# EAGLE design HitBoxV0.3 (EAGLE 9.1.3)
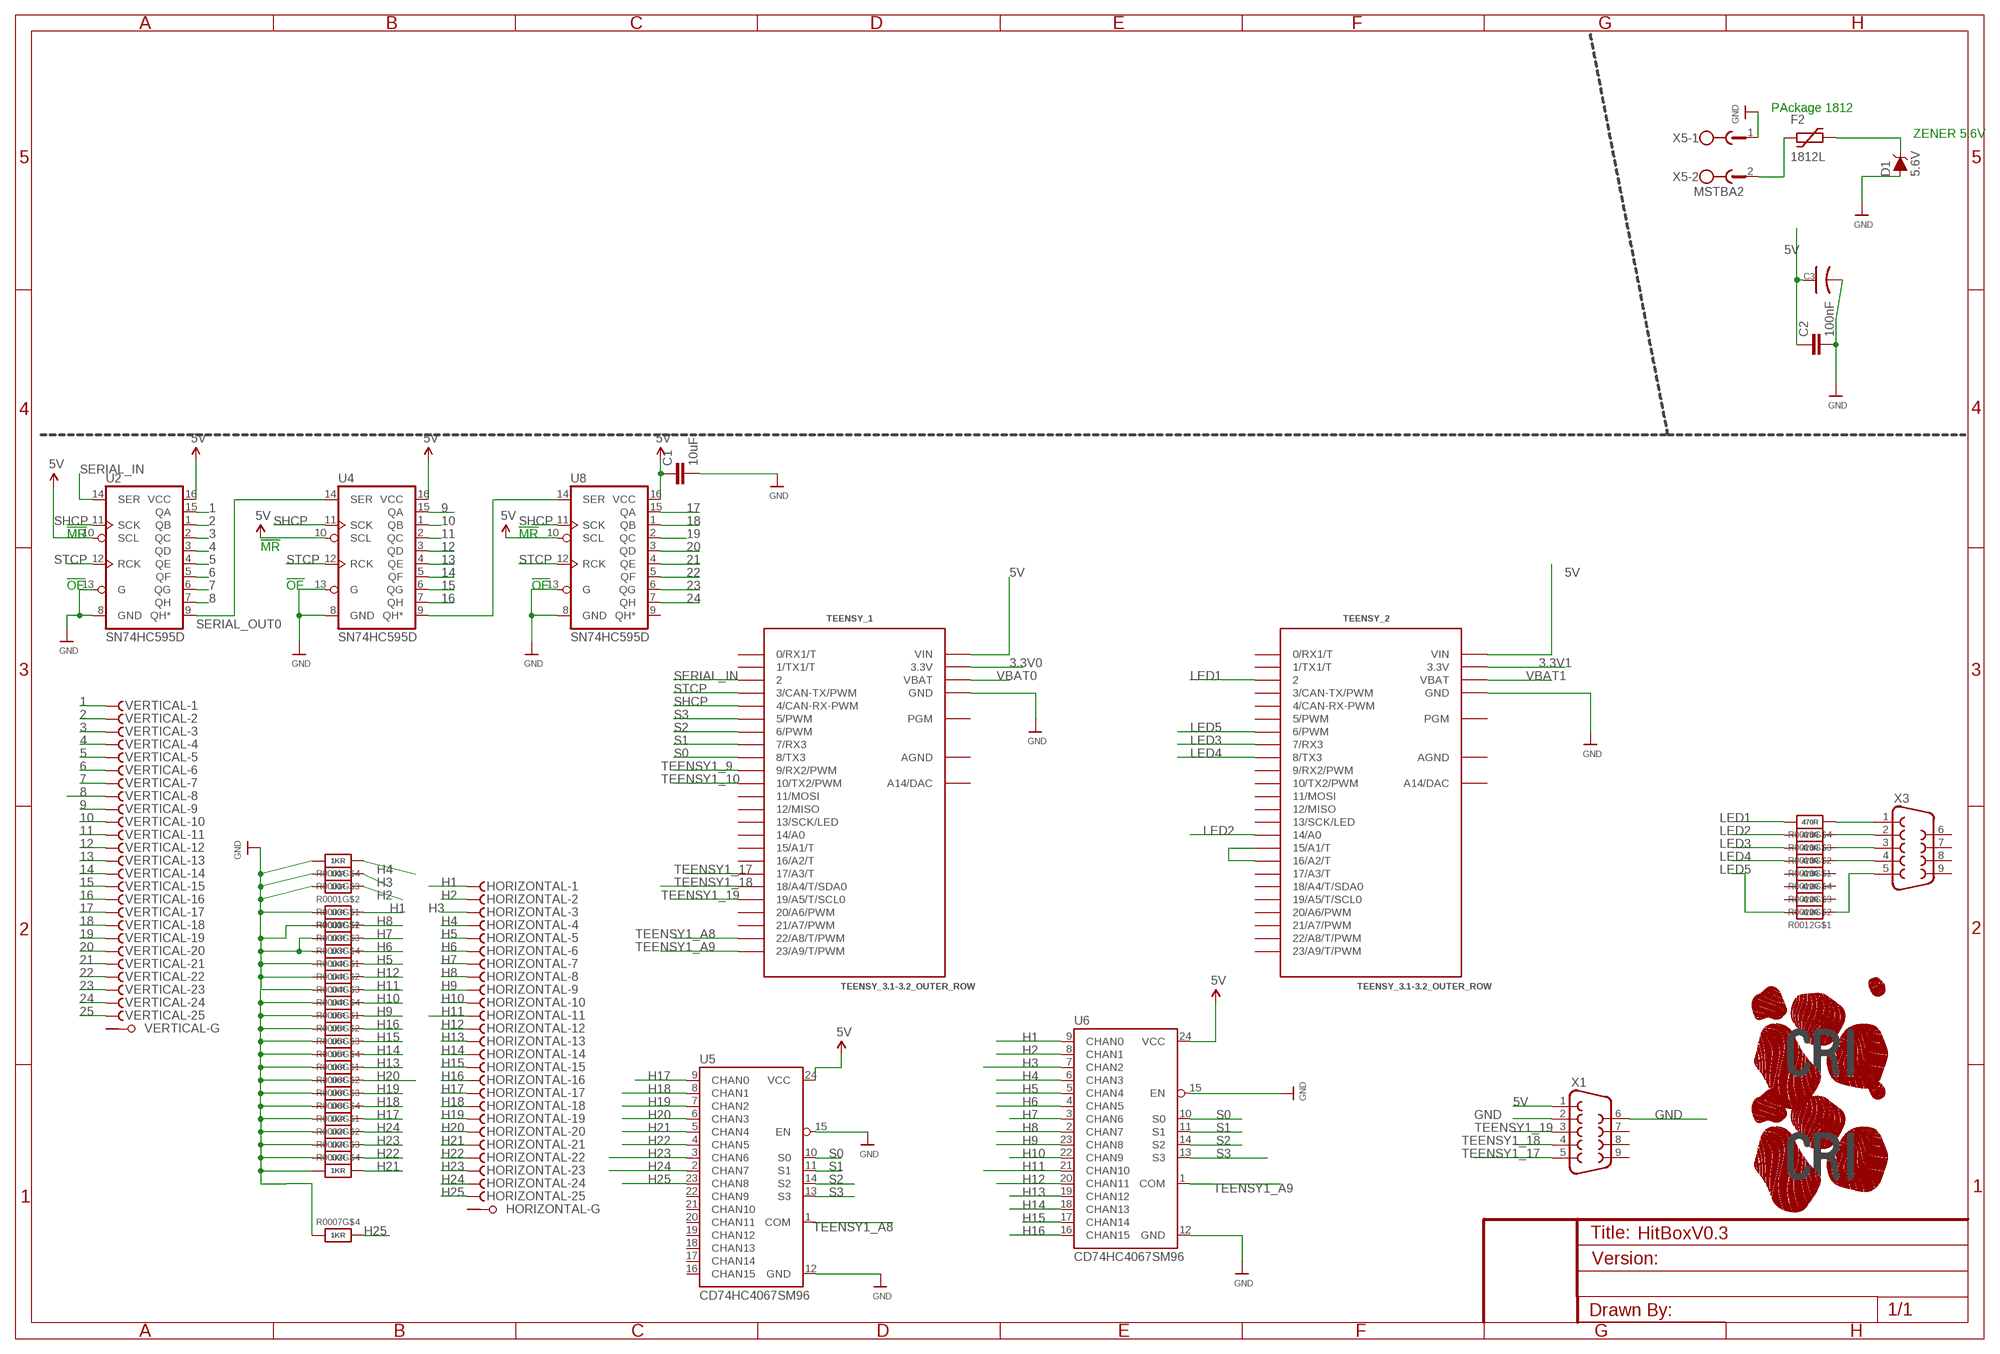
[diagram p0: schematic, sheet 1]

## Parts
C1  10uF  CAP0402-10UF-KEMET  [0402-CAP]
C2  100nF  C-EUC0805  [C0805]
C3  C-POLAR8MMX10MM  [CAP-POL-8MMX10MM]
D1  5.6V  DIODE-ZENER-MMSZ5232BS  [SOD-323]
F2  1812L  [1812L]
HORIZONTAL  F25VPS  [F25VP]
R0001  1KR  RESISTOR_4PACK  [RESPACK_4X0603]
R0002  1KR  RESISTOR_4PACK  [RESPACK_4X0603]
R0003  1KR  RESISTOR_4PACK  [RESPACK_4X0603]
R0004  1KR  RESISTOR_4PACK  [RESPACK_4X0603]
R0005  1KR  RESISTOR_4PACK  [RESPACK_4X0603]
R0006  1KR  RESISTOR_4PACK  [RESPACK_4X0603]
R0007  1KR  RESISTOR_4PACK  [RESPACK_4X0603]
R0012  470R  RESISTOR_4PACK  [RESPACK_4X0603]
R0013  470R  RESISTOR_4PACK  [RESPACK_4X0603]
TEENSY_1  TEENSY_3.1-3.2_OUTER_ROW  [TEENSY_3.0-3.2&LC_OUTER_ROW]
TEENSY_2  TEENSY_3.1-3.2_OUTER_ROW  [TEENSY_3.0-3.2&LC_OUTER_ROW]
U2  SN74HC595D  74HC595D  [SO16]
U4  SN74HC595D  74HC595D  [SO16]
U5  CD74HC4067SM96  74HC4067SM96  [SSOP24]
U6  CD74HC4067SM96  74HC4067SM96  [SSOP24]
U8  SN74HC595D  74HC595D  [SO16]
U$8  LOGO-CRI-NEW-150MM-TOP-TPLACE  [LOGO_CRI-NEW-BMP50MM-TOP]
U$10  LOGO-CRI-NEW-130MMX30MM-TPLACE  [LOGO_CRI-NEW-BMP30MM-TOP]
VERTICAL  F25VPS  [F25VP]
X1  F09VP  [F09VP]
X3  F09VP  [F09VP]
X5  MSTBA2  [MSTBA2]

## Nets
1: U2.15(QA) VERTICAL.1(-1:F)
2: U2.1(QB) VERTICAL.2(-2:F)
3: U2.2(QC) VERTICAL.3(-3:F)
3.3V0: TEENSY_1.3.3V TEENSY_1.3.3V1(3.3V)
3.3V1: TEENSY_2.3.3V TEENSY_2.3.3V1(3.3V)
4: U2.3(QD) VERTICAL.4(-4:F)
5: U2.4(QE) VERTICAL.5(-5:F)
5V: C1.1 C2.1 C3.+ D1.C F2.P$2 TEENSY_1.VIN TEENSY_2.VIN U2.10(SCL) U2.16(VCC) U4.10(SCL) U4.16(VCC) U5.24(VCC) U6.24(VCC) U8.10(SCL) U8.16(VCC) X1.1
6: U2.5(QF) VERTICAL.6(-6:F)
7: U2.6(QG) VERTICAL.7(-7:F)
8: U2.7(QH) VERTICAL.8(-8:F)
9: U4.15(QA) VERTICAL.9(-9:F)
10: U4.1(QB) VERTICAL.10(-10:F)
11: U4.2(QC) VERTICAL.11(-11:F)
12: U4.3(QD) VERTICAL.12(-12:F)
13: U4.4(QE) VERTICAL.13(-13:F)
14: U4.5(QF) VERTICAL.14(-14:F)
15: U4.6(QG) VERTICAL.15(-15:F)
16: U4.7(QH) VERTICAL.16(-16:F)
17: U8.15(QA) VERTICAL.17(-17:F)
18: U8.1(QB) VERTICAL.18(-18:F)
19: U8.2(QC) VERTICAL.19(-19:F)
20: U8.3(QD) VERTICAL.20(-20:F)
21: U8.4(QE) VERTICAL.21(-21:F)
22: U8.5(QF) VERTICAL.22(-22:F)
23: U8.6(QG) VERTICAL.23(-23:F)
24: U8.7(QH) VERTICAL.24(-24:F)
25: VERTICAL.25(-25:F)
GND: C1.2 C2.2 C3.- D1.A R0001.5 R0001.6 R0001.7 R0001.8 R0002.1 R0002.2 R0002.3 R0002.4 R0003.1 R0003.2 R0003.3 R0003.4 R0004.1 R0004.2 R0004.3 R0004.4 R0005.1 R0005.2 R0005.3 R0005.4 R0006.1 R0006.2 R0006.3 R0006.4 R0007.4 TEENSY_1.GND TEENSY_1.GND1(GND) TEENSY_2.GND TEENSY_2.GND1(GND) U2.8(GND) U2.13(G) U4.8(GND) U4.13(G) U5.12(GND) U5.15(EN) U6.12(GND) U6.15(EN) U8.8(GND) U8.13(G) X1.2 X1.6 X5.1
H1: HORIZONTAL.1(-1:F) R0001.1 U6.9(CHAN0)
H2: HORIZONTAL.2(-2:F) R0001.2 U6.8(CHAN1)
H3: HORIZONTAL.3(-3:F) R0001.3 U6.7(CHAN2)
H4: HORIZONTAL.4(-4:F) R0001.4 U6.6(CHAN3)
H5: HORIZONTAL.5(-5:F) R0003.5 U6.5(CHAN4)
H6: HORIZONTAL.6(-6:F) R0003.6 U6.4(CHAN5)
H7: HORIZONTAL.7(-7:F) R0003.7 U6.3(CHAN6)
H8: HORIZONTAL.8(-8:F) R0003.8 U6.2(CHAN7)
H9: HORIZONTAL.9(-9:F) R0004.5 U6.23(CHAN8)
H10: HORIZONTAL.10(-10:F) R0004.6 U6.22(CHAN9)
H11: HORIZONTAL.11(-11:F) R0004.7 U6.21(CHAN10)
H12: HORIZONTAL.12(-12:F) R0004.8 U6.20(CHAN11)
H13: HORIZONTAL.13(-13:F) R0005.5 U6.19(CHAN12)
H14: HORIZONTAL.14(-14:F) R0005.6 U6.18(CHAN13)
H15: HORIZONTAL.15(-15:F) R0005.7 U6.17(CHAN14)
H16: HORIZONTAL.16(-16:F) R0005.8 U6.16(CHAN15)
H17: HORIZONTAL.17(-17:F) R0006.5 U5.9(CHAN0)
H18: HORIZONTAL.18(-18:F) R0006.6 U5.8(CHAN1)
H19: HORIZONTAL.19(-19:F) R0006.7 U5.7(CHAN2)
H20: HORIZONTAL.20(-20:F) R0006.8 U5.6(CHAN3)
H21: HORIZONTAL.21(-21:F) R0002.5 U5.5(CHAN4)
H22: HORIZONTAL.22(-22:F) R0002.6 U5.4(CHAN5)
H23: HORIZONTAL.23(-23:F) R0002.7 U5.3(CHAN6)
H24: HORIZONTAL.24(-24:F) R0002.8 U5.2(CHAN7)
H25: HORIZONTAL.25(-25:F) R0007.5 U5.23(CHAN8)
LED1: R0013.5 TEENSY_2.2
LED2: R0013.6 TEENSY_2.14/A0
LED3: R0013.7 TEENSY_2.7(7/RX3)
LED4: R0013.8 TEENSY_2.8(8/TX3)
LED5: R0012.8 TEENSY_2.6(6/PWM)
N$2: R0013.4 X3.1
N$3: R0013.3 X3.2
N$4: U4.9(QH*) U8.14(SER)
N$6: R0013.2 X3.3
N$7: R0013.1 X3.4
N$8: TEENSY_2.15/A1(15/A1/T) TEENSY_2.16/A2(16/A2/T)
N$10: F2.P$1 X5.2
N$20: R0012.1 X3.5
S0: TEENSY_1.8(8/TX3) U5.10(S0) U6.10(S0)
S1: TEENSY_1.7(7/RX3) U5.11(S1) U6.11(S1)
S2: TEENSY_1.6(6/PWM) U5.14(S2) U6.14(S2)
S3: TEENSY_1.5(5/PWM) U5.13(S3) U6.13(S3)
SERIAL_IN: TEENSY_1.2 U2.14(SER)
SERIAL_OUT0: U2.9(QH*) U4.14(SER)
SHCP: TEENSY_1.4(4/CAN-RX-PWM) U2.11(SCK) U4.11(SCK) U8.11(SCK)
STCP: TEENSY_1.3(3/CAN-TX/PWM) U2.12(RCK) U4.12(RCK) U8.12(RCK)
TEENSY1_9: TEENSY_1.9(9/RX2/PWM)
TEENSY1_10: TEENSY_1.10(10/TX2/PWM)
TEENSY1_17: TEENSY_1.17/A3(17/A3/T) X1.5
TEENSY1_18: TEENSY_1.18/A4(18/A4/T/SDA0) X1.4
TEENSY1_19: TEENSY_1.19/A5(19/A5/T/SCL0) X1.3
TEENSY1_A8: TEENSY_1.22/A8(22/A8/T/PWM) U5.1(COM)
TEENSY1_A9: TEENSY_1.23/A9(23/A9/T/PWM) U6.1(COM)
VBAT0: TEENSY_1.VBAT
VBAT1: TEENSY_2.VBAT
Unconnected: HORIZONTAL.G1(-G:G1) HORIZONTAL.G2(-G:G2) R0007.1 R0007.2 R0007.3 R0007.6 R0007.7 R0007.8 R0012.2 R0012.3 R0012.4 R0012.5 R0012.6 R0012.7 TEENSY_1.0(0/RX1/T) TEENSY_1.1(1/TX1/T) TEENSY_1.11(11/MOSI) TEENSY_1.12(12/MISO) TEENSY_1.13(13/SCK/LED) TEENSY_1.14/A0 TEENSY_1.15/A1(15/A1/T) TEENSY_1.16/A2(16/A2/T) TEENSY_1.20/A6(20/A6/PWM) TEENSY_1.21/A7(21/A7/PWM) TEENSY_1.PGM TEENSY_1.RESET/DAC(A14/DAC) TEENSY_2.0(0/RX1/T) TEENSY_2.1(1/TX1/T) TEENSY_2.3(3/CAN-TX/PWM) TEENSY_2.4(4/CAN-RX-PWM) TEENSY_2.5(5/PWM) TEENSY_2.9(9/RX2/PWM) TEENSY_2.10(10/TX2/PWM) TEENSY_2.11(11/MOSI) TEENSY_2.12(12/MISO) TEENSY_2.13(13/SCK/LED) TEENSY_2.17/A3(17/A3/T) TEENSY_2.18/A4(18/A4/T/SDA0) TEENSY_2.19/A5(19/A5/T/SCL0) TEENSY_2.20/A6(20/A6/PWM) TEENSY_2.21/A7(21/A7/PWM) TEENSY_2.22/A8(22/A8/T/PWM) TEENSY_2.23/A9(23/A9/T/PWM) TEENSY_2.PGM TEENSY_2.RESET/DAC(A14/DAC) U5.16(CHAN15) U5.17(CHAN14) U5.18(CHAN13) U5.19(CHAN12) U5.20(CHAN11) U5.21(CHAN10) U5.22(CHAN9) U8.9(QH*) VERTICAL.G1(-G:G1) VERTICAL.G2(-G:G2) X1.7 X1.8 X1.9 X3.6 X3.7 X3.8 X3.9

## Notes on the sheet
- PAckage 1812
- ZENER 5.6V
- !MR! | !MR!
- !MR!
- !OE! | !OE! | !OE!

## Power pins joined to a net without a drawn wire
AGND: TEENSY_1.AGND TEENSY_2.AGND

## Library data of the parts
C1 = movuino:CAP: Capacitor Standard 0402 ceramic capacitor 0.1uF , 100nF; DIELECTRIC: MLCC, X5R; MF: Kemet; MPN: C0402C106M9PACTU; OC_MOUSER: 80-C0402C106M9P; TOLERANCE: 20%; VOLTAGE: 6.3V
C2 = resistor:C-EU: CAPACITOR, European symbol
C3 = movuinoV0:C-POLAR*
D1 = SparkFun-DiscreteSemi:DIODE-ZENER: Zener Diode A Zener diode allows current to flow from its anode to its cathode like a normal semiconductor diode, but it also permits current to flow in the reverse direction when its "Zener voltage" is reached. - WIkipedia; PROD_ID: DIO-12442
F2 = ptc-littlefuse:1812L
HORIZONTAL VERTICAL = con-subd:F25VPS: SUB-D; OC_FARNELL: unknown; OC_NEWARK: unknown
R0001-R0007 R0012 R0013 = microbuilder:RESISTOR_4PACK: Resistor Packs (4 resistors) 4 x 0603 10K 1/16W - Digikey: YC164J-10KCT-ND
TEENSY_1 TEENSY_2 = Teensy_3_and_LC_Series_Boards_v1.4:TEENSY_3.1-3.2_OUTER_ROW: Footprint for Teensy 3.1 or 3.2 board using all pin connections on the outer perimeter
U2 U4 U8 = SparkFun-IC-Logic:74*595: 8-Bit Shift Register (Serial to Parallel) Datasheet <http://cdn.sparkfun.com/datasheets/BreakoutBoards/MM74HC595.pdf> SparkFun Products SparkFun Shift Register Breakout - 74HC595 <https://www.sparkfun.com/products/10680> (BOB-10680); PROD_ID: IC-07875
U5 U6 = SparkFun-IC-Logic:74*4067: 16-channel analog MUX Datasheet <http://www.sparkfun.com/datasheets/IC/cd74hc4067.pdf> SparkFun Products MP3 Trigger <https://www.sparkfun.com/products/13720> (WIG-13720) SparkFun Analog/Digital MUX Breakout - CD74HC4067 <https://www.sparkfun.com/products/9056> (BOB-09056); PROD_ID: IC-08252
U$8 U$10 = movuino_aestheticsV0:LOGO-CRI-NEW-1
X1 X3 = con-subd:F09: SUB-D; OC_FARNELL: unknown; OC_NEWARK: unknown
X5 = con-phoenix-508:MSTBA2: PHOENIX; MF: FARNELL; MPN: 1757242; OC_FARNELL: 3705171; OC_NEWARK: 71C4161

## Net classes
1 pcbway_smallest: width 0.102 mm, drill 0.2 mm, clearance 0.102 mm

## Board
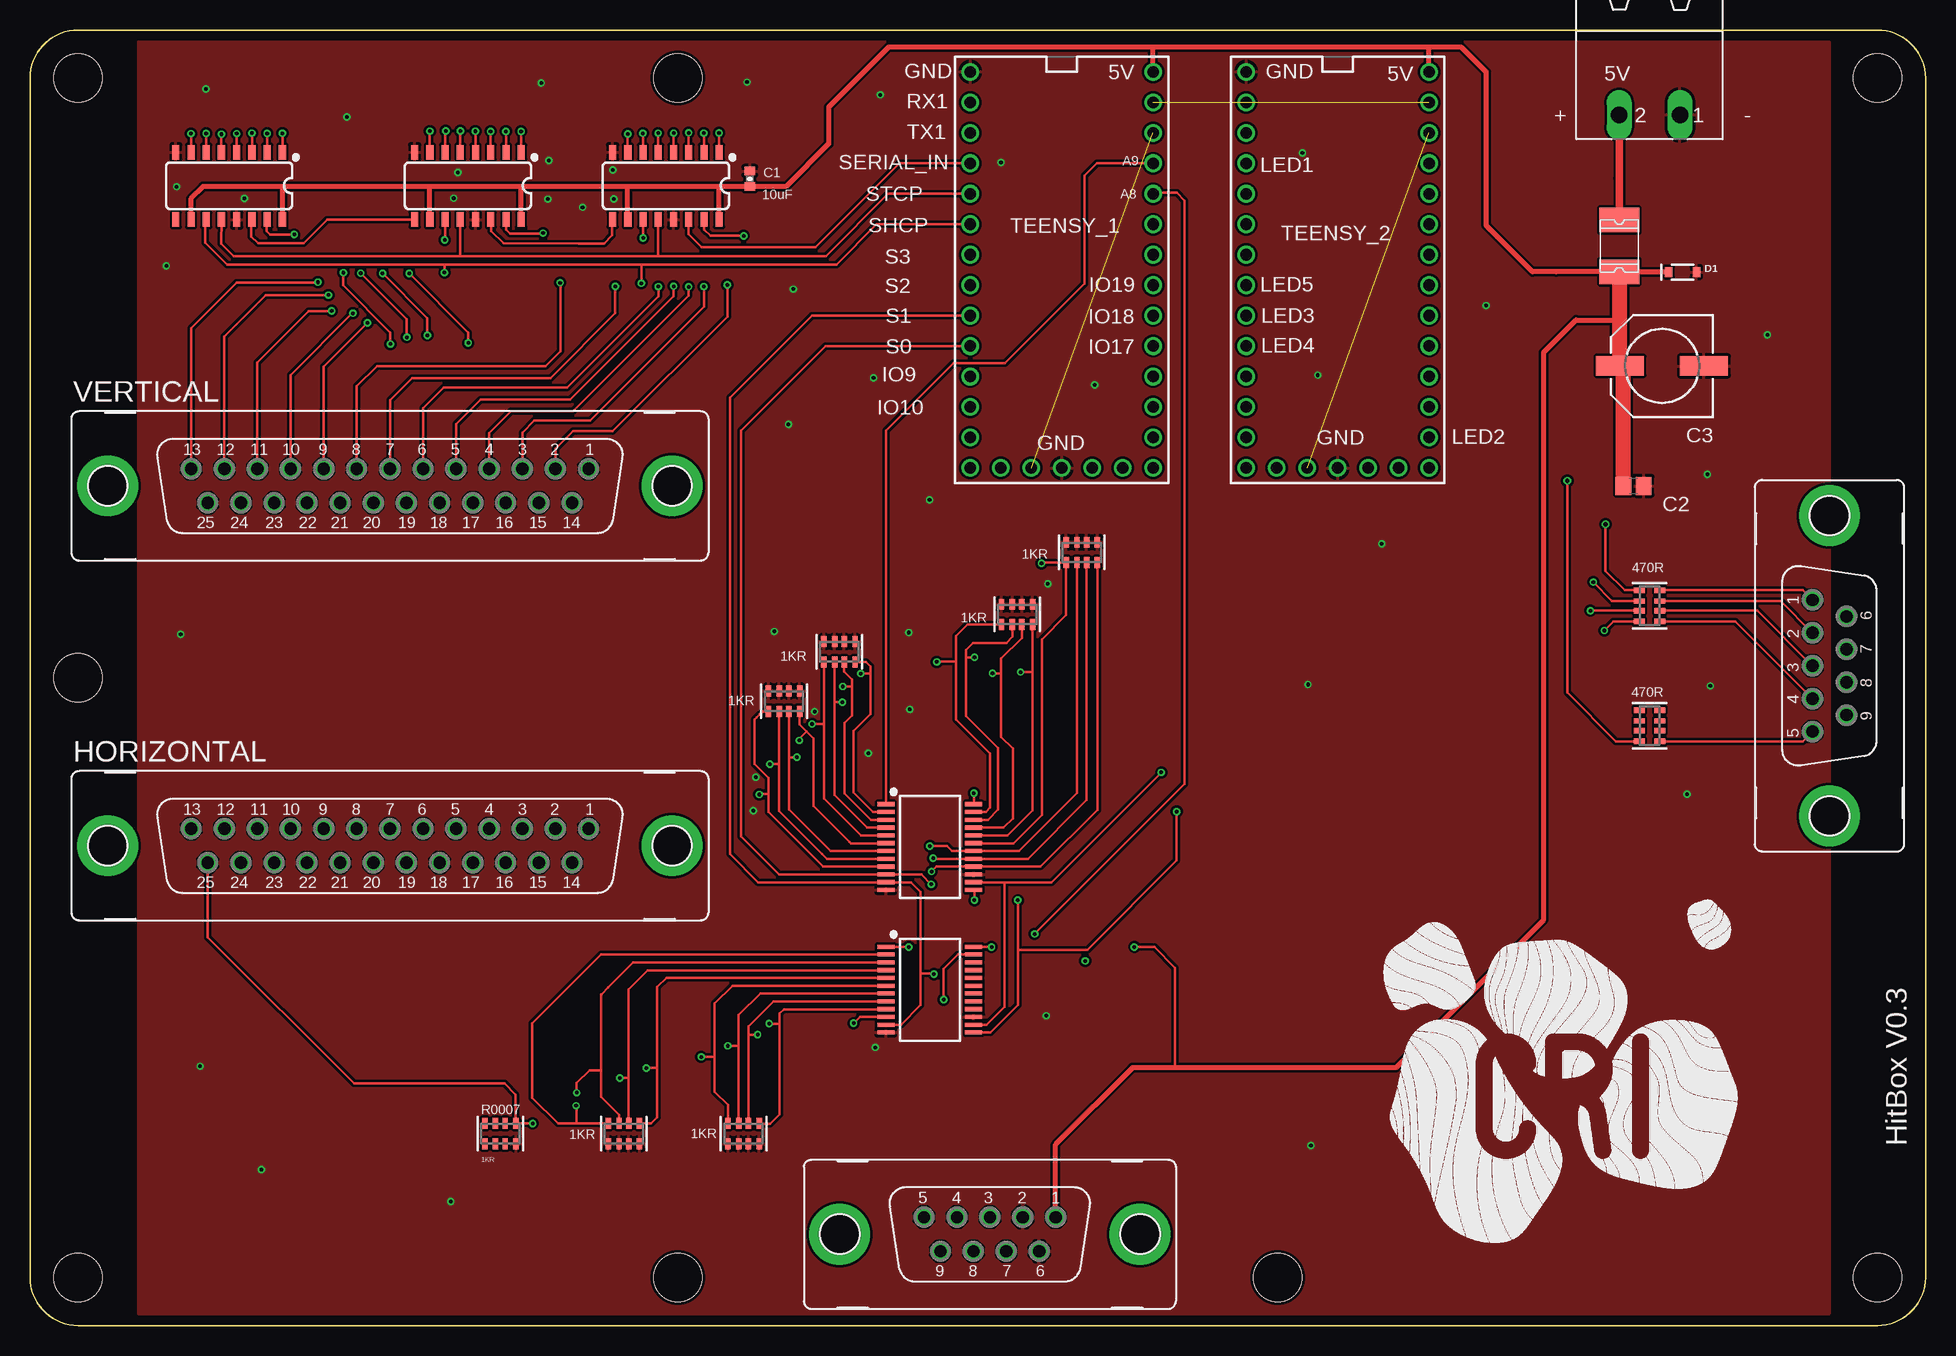
[diagram p1: board, top side]
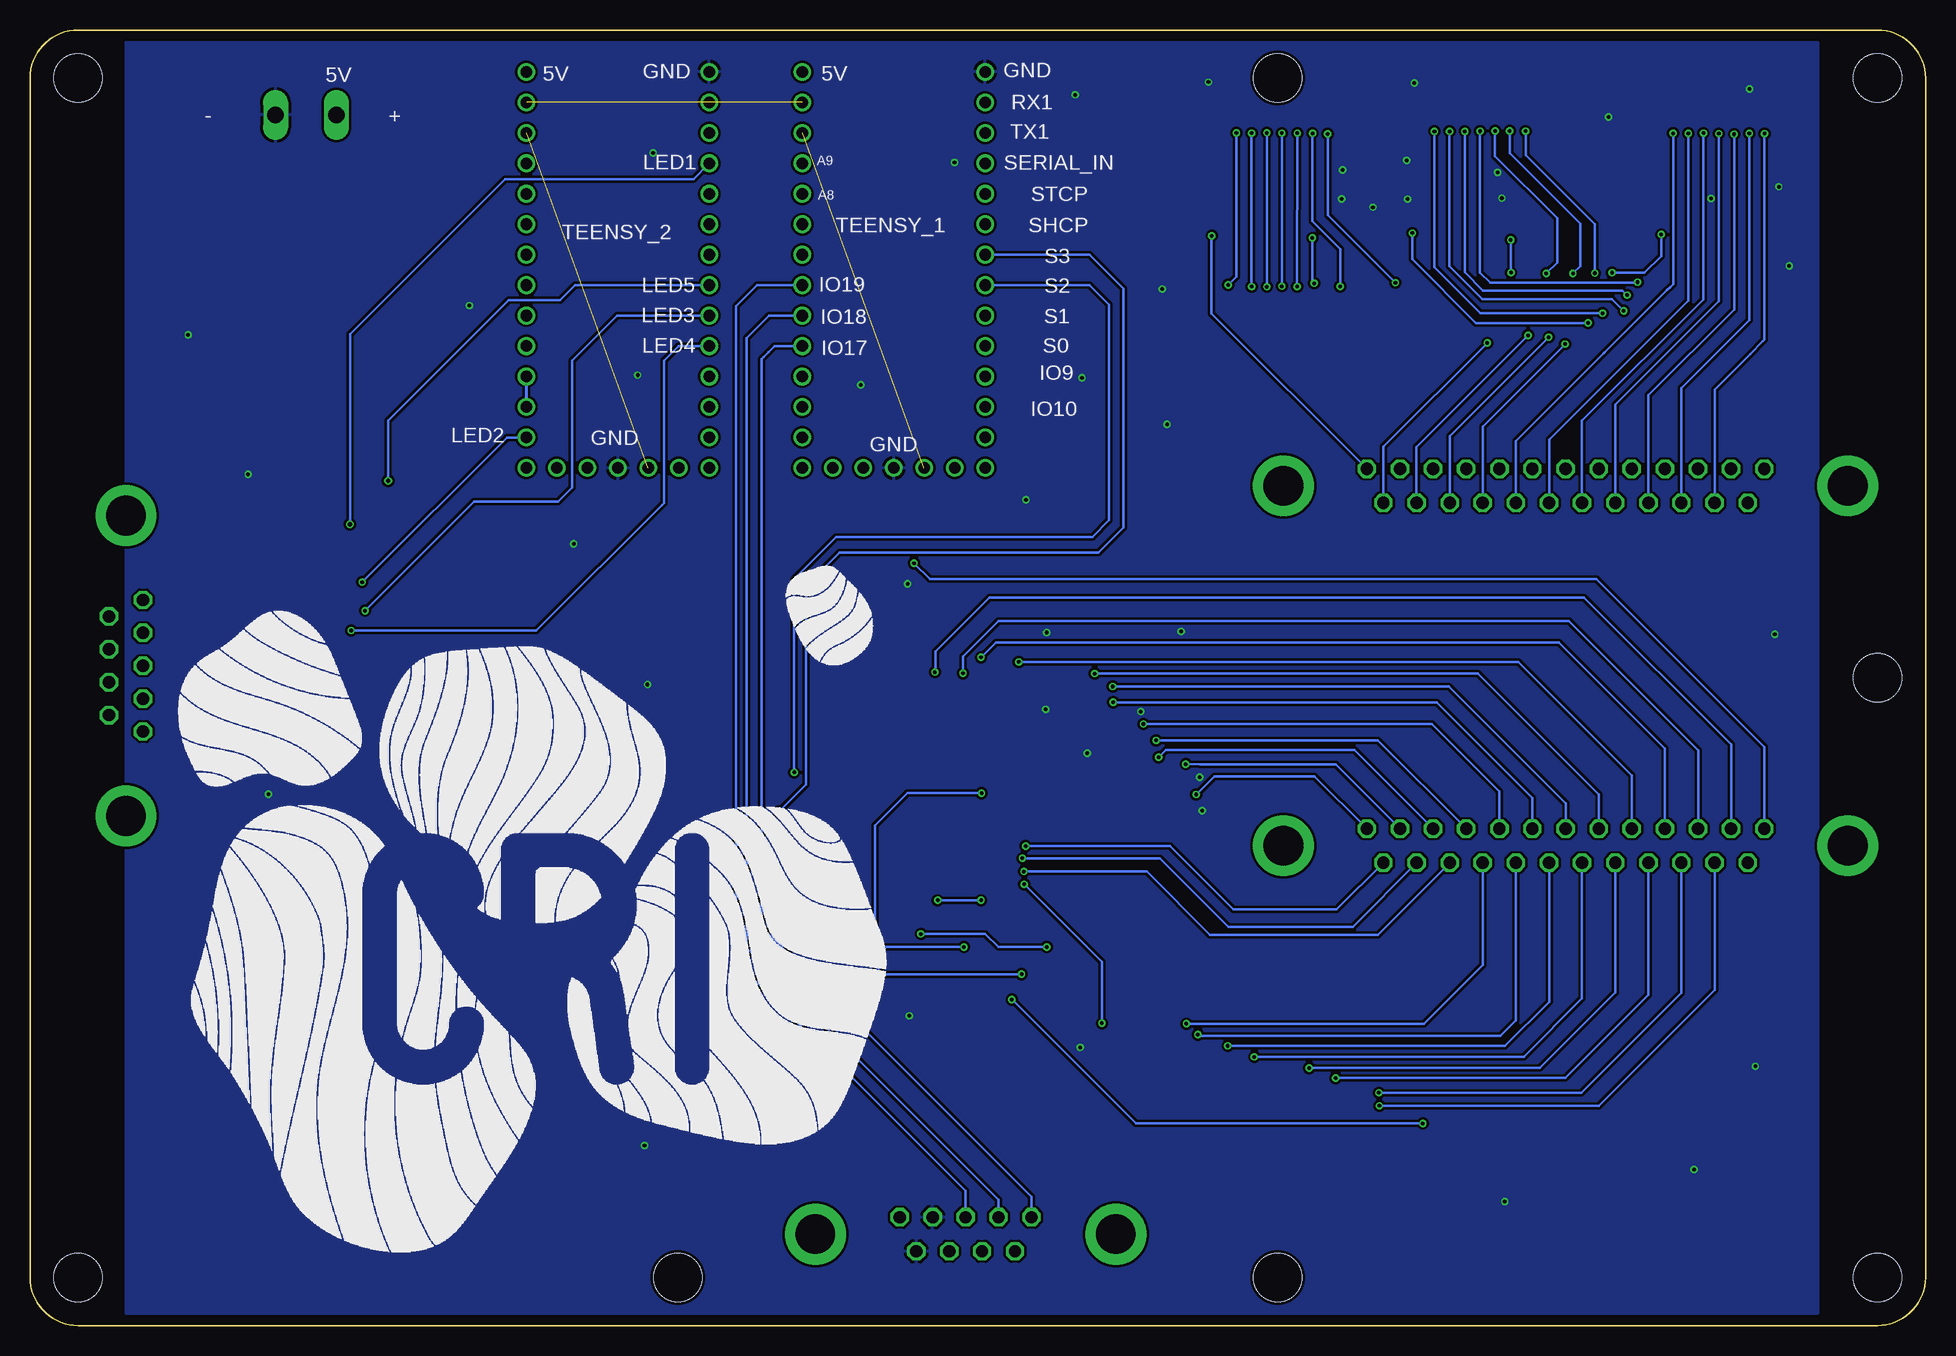
[diagram p2: board, bottom side, seen from below]

Size 158 x 108 mm. Coordinates in mm from the lower left corner, seen from the top.
Outline: 0,104 0,4 arc90 4,0 154,0 arc90 158,4 158,104 arc90 154,108 4,108 arc90 0,104
Copper layers (1*16): Top 0.035mm / dielectric 1.5mm / Bottom 0.035mm
Design rules "PCBWAY_2layer_DRU_no_angle_cheap": minimum track width 0.2mm, minimum drill 0.3mm, track to track 6mil, track to pad 6mil, pad to pad 6mil, via to via 6mil, smd to smd 0mil, copper to edge 10mil, drill to drill 10mil, minimum pad ring 10mil, minimum via ring 6mil, stop-mask expansion 2mil, vias tented up to drill 100mil, thermal gap 10mil
Holes 4 mm at 154,104 4,104 4,4 54,4 4,54 104,4 154,4 54,104

### Footprints (pad centres in the part's own frame; a part is rotated, then mirrored left to right if it is on the bottom)
0402-CAP = smd 0.7 x 0.9: 1 -0.65,0; 2 0.65,0
C0805 = smd 1.3 x 1.5: 1 -0.85,0; 2 0.85,0
CAP-POL-8MMX10MM = smd 4 x 1.6: + 3.5,0; - -3.5,0
SOD-323 = smd 0.63 x 0.83: A 1.15,0; C -1.15,0
1812L = smd 2.03 x 3.3: P$1 -2.16,0; P$2 2.16,0
F25VP = drill 1.016 octagon: 1 16.561,1.422; 2 13.792,1.422; 3 11.049,1.422; 4 8.28,1.422; 5 5.512,1.422; 6 2.769,1.422; 7 0,1.422; 8 -2.769,1.422; 9 -5.512,1.422; 10 -8.28,1.422; 11 -11.049,1.422; 12 -13.792,1.422; 13 -16.561,1.422; 14 15.189,-1.422; 15 12.421,-1.422; 16 9.652,-1.422; 17 6.909,-1.422; 18 4.14,-1.422; 19 1.372,-1.422; 20 -1.372,-1.422; 21 -4.14,-1.422; 22 -6.909,-1.422; 23 -9.652,-1.422; 24 -12.421,-1.422; 25 -15.189,-1.422 | drill 3.302 pad 5.08: G1 -23.52,0; G2 23.52,0
RESPACK_4X0603 = smd 0.45 x 0.9: 1 -1.3,-0.85; 2 -0.4,-0.85; 3 0.4,-0.85; 4 1.3,-0.85; 5 1.3,0.85; 6 0.4,0.85; 7 -0.4,0.85; 8 -1.3,0.85
TEENSY_3.0-3.2&LC_OUTER_ROW = drill 0.965: 0 -7.62,13.97; 1 -7.62,11.43; 2 -7.62,8.89; 3 -7.62,6.35; 3.3V 7.62,11.43; 3.3V1 -2.54,-16.51; 4 -7.62,3.81; 5 -7.62,1.27; 6 -7.62,-1.27; 7 -7.62,-3.81; 8 -7.62,-6.35; 9 -7.62,-8.89; 10 -7.62,-11.43; 11 -7.62,-13.97; 12 -7.62,-16.51; 13 7.62,-16.51; 14/A0 7.62,-13.97; 15/A1 7.62,-11.43; 16/A2 7.62,-8.89; 17/A3 7.62,-6.35; 18/A4 7.62,-3.81; 19/A5 7.62,-1.27; 20/A6 7.62,1.27; 21/A7 7.62,3.81; 22/A8 7.62,6.35; 23/A9 7.62,8.89; AGND 7.62,13.97; GND -7.62,16.51; GND1 0,-16.51; PGM 2.54,-16.51; RESET/DAC 5.08,-16.51; VBAT -5.08,-16.51; VIN 7.62,16.51
SO16 = smd 0.6 x 1.2: 1 -4.445,-2.8; 2 -3.175,-2.8; 3 -1.905,-2.8; 4 -0.635,-2.8; 5 0.635,-2.8; 6 1.905,-2.8; 7 3.175,-2.8; 8 4.445,-2.8; 9 4.445,2.8; 10 3.175,2.8; 11 1.905,2.8; 12 0.635,2.8; 13 -0.635,2.8; 14 -1.905,2.8; 15 -3.175,2.8; 16 -4.445,2.8
SSOP24 = smd 0.348 x 1.397: 1 -3.575,-3.656; 2 -2.925,-3.656; 3 -2.275,-3.656; 4 -1.625,-3.656; 5 -0.975,-3.656; 6 -0.325,-3.656; 7 0.325,-3.656; 8 0.975,-3.656; 9 1.625,-3.656; 10 2.275,-3.656; 11 2.925,-3.656; 12 3.575,-3.656; 13 3.575,3.656; 14 2.925,3.656; 15 2.275,3.656; 16 1.625,3.656; 17 0.975,3.656; 18 0.325,3.656; 19 -0.325,3.656; 20 -0.975,3.656; 21 -1.625,3.656; 22 -2.275,3.656; 23 -2.925,3.656; 24 -3.575,3.656
F09VP = drill 1.016 octagon: 1 5.486,1.422; 2 2.743,1.422; 3 0,1.422; 4 -2.743,1.422; 5 -5.486,1.422; 6 4.115,-1.422; 7 1.372,-1.422; 8 -1.372,-1.422; 9 -4.115,-1.422 | drill 3.302 pad 5.08: G1 -12.522,0; G2 12.522,0
MSTBA2 = drill 1.397 long: 1 -2.54,5.08; 2 2.54,5.08

### Placement (x,y rotation side)
C1  60,95.6 90 top
C2  133.66,70 0 top
C3  136.04,80 180 top
D1  137.75,87.83 0 top
F2  132.48,90 270 top
HORIZONTAL  30,40 0 top
R0001  62.85,52.05 0 top
R0002  49.5,16 0 top
R0003  67.47,56.16 180 top
R0004  82.28,59.28 180 top
R0005  87.67,64.45 180 top
R0006  59.48,16 0 top
R0007  39.2,16 0 top
R0012  135,50 90 top
R0013  135,60 90 top
TEENSY_1  86,88 0 top
TEENSY_2  109,88 0 top
U2  53,95 180 top
U4  36.5,95 180 top
U5  75,28 270 top
U6  75,39.88 270 top
U8  16.6,95 180 top
U$8  114.18,31.3 0 bottom
U$10  128.96,19.38 0 top
VERTICAL  30,70 0 top
X1  80.01,7.61 0 top
X3  150,55 90 top
X5  135,106 180 top

### Tracks (layer width: path | path; a pad name or v marks a point on that pad's centre or on a via)
1  (via drill 0.3 pad 0.6)
  Top 0.203: U2.15 56.17,91.38 56.71,90.84 v59.49,90.84
  Bottom 0.203: VERTICAL.1 59.51,84.37 59.51,90.82 v59.49,90.84
2  (via drill 0.3 pad 0.6)
  Top 0.203: VERTICAL.2 43.79,73.09 45.26,74.56 48.57,74.56 58.13,84.12 v58.13,86.75 | U2.1 v57.45,99.42 v57.44,99.42
  Bottom 0.203: v57.44,99.42 57.44,87.44 v58.13,86.75
3  (via drill 0.3 pad 0.6)
  Top 0.203: VERTICAL.3 41.05,74.45 42.04,75.44 46.68,75.44 56.17,84.93 v56.17,86.61 | U2.2 v56.17,99.39 v56.17,99.4
  Bottom 0.203: v56.17,99.4 v56.17,86.61
3.3V0  (1 unrouted)
3.3V1  (1 unrouted)
4  (via drill 0.3 pad 0.6)
  Top 0.203: VERTICAL.4 38.28,74.39 40.11,76.22 45.26,76.22 54.9,85.86 v54.9,86.6 | U2.3 v54.91,99.42 v54.9,99.43
  Bottom 0.203: v54.9,86.6 v54.9,99.43
5  (via drill 0.3 pad 0.6)
  Top 0.203: VERTICAL.5 35.51,75.13 37.55,77.17 45,77.17 53.64,85.81 v53.64,86.63 v53.65,86.64 | U2.4 53.63,99.39 v53.65,99.4
  Bottom 0.203: v53.65,86.64 v53.65,99.4
5V  (via drill 0.3 pad 0.6)
  Top 0.203: U5.24 80.12,31.57 v80.15,31.55 | U6.24 78.67,43.53 v78.68,44.38 | 95.45,21.48 95.45,29.83 93.73,31.55 v92.05,31.55
  Top 0.406: U8.10 13.4,92.19 13.4,93.93 14.42,94.95 21.16,94.95 | 116.59,106.58 119.3,106.58 121.39,104.49 121.39,91.69 125.24,87.84 127.21,87.84 F2.P$2 D1.C | 116.59,106.58 93.69,106.58 | X1.1 85.5,15.09 91.89,21.48 95.45,21.48 113.84,21.48 126.18,33.82 126.18,81.14 128.87,83.83 132.48,83.83 | TEENSY_2.VIN 116.62,106.55 116.59,106.58 | TEENSY_1.VIN 93.62,106.51 93.69,106.58 | 93.69,106.58 71.58,106.58 66.58,101.58 66.58,98.52 63.01,94.95 C1.1 57.37,94.95 | 57.37,94.95 49.89,94.95 | 49.89,94.95 41.07,94.95 | 41.07,94.95 33.35,94.95 | 33.35,94.95 21.16,94.95 | U2.10 49.83,94.89 49.89,94.95 | U2.16 57.45,94.88 57.37,94.95 | U4.10 33.33,94.92 33.35,94.95 | U4.16 40.95,94.83 41.07,94.95 | U8.16 21.05,94.83 21.16,94.95
  Top 1.27: C2.1 132.81,79.73 | 132.81,79.73 C3.+ | F2.P$2 132.48,83.83 132.48,80.06 132.81,79.73
  Bottom 0.203: v80.15,31.55 87.56,31.55 | 87.56,31.55 v92.05,31.55 | 87.56,31.55 87.55,31.56 87.55,41.69 84.86,44.38 v78.68,44.38
6  (via drill 0.3 pad 0.6)
  Top 0.203: VERTICAL.6 32.77,76.46 34.49,78.18 44.75,78.18 52.38,85.81 v52.38,86.61 | U2.5 v52.37,99.39 v52.36,99.4
  Bottom 0.203: v52.38,86.61 v52.36,99.4
7  (via drill 0.3 pad 0.6)
  Top 0.203: VERTICAL.7 30,77.14 31.85,78.99 43.39,78.99 48.79,84.39 v48.79,86.63 | U2.6 v51.09,99.39
  Bottom 0.203: v48.79,86.63 48.79,89.75 51.09,92.05 v51.09,99.39
8  (via drill 0.3 pad 0.6)
  Top 0.203: VERTICAL.8 27.23,78.3 28.93,80 42.99,80 44.22,81.23 44.22,86.9 v44.19,86.93 | U2.7 v49.83,99.33
  Bottom 0.203: v49.83,99.33 49.83,92.57 v44.19,86.93
9  (via drill 0.3 pad 0.6)
  Top 0.203: U4.15 39.67,91.38 40.03,91.02 42.72,91.02 v42.77,91.07 | VERTICAL.9 24.49,79.95 v28.12,83.58
  Bottom 0.203: v42.77,91.07 42.77,88.88 37.47,83.58 v28.12,83.58
10  (via drill 0.3 pad 0.6)
  Top 0.203: U4.1 v40.95,99.55 v40.94,99.55 | v26.92,84.39 26.86,84.39 21.72,79.25 VERTICAL.10
  Bottom 0.203: v26.92,84.39 37.11,84.39 40.94,88.22 v40.94,99.55
11  (via drill 0.3 pad 0.6)
  Top 0.203: U4.2 v39.67,99.55 | v25.15,84.58 23.24,84.58 18.95,80.29 VERTICAL.11
  Bottom 0.203: v39.67,99.55 39.67,88.3 36.93,85.56 26.13,85.56 v25.15,84.58
12  (via drill 0.3 pad 0.6)
  Top 0.203: U4.3 v38.41,99.55 v38.4,99.55 | v24.88,85.9 19.65,85.9 16.21,82.46 VERTICAL.12
  Bottom 0.203: v38.4,99.55 38.4,87.8 36.89,86.29 25.27,86.29 v24.88,85.9
13  (via drill 0.3 pad 0.6)
  Top 0.203: VERTICAL.13 13.44,83.15 17.24,86.95 23.97,86.95 v24,86.98 | U4.4 v37.13,99.56
  Bottom 0.203: v37.13,99.56 37.13,87.78 36.28,86.93 24.05,86.93 v24,86.98
14  (via drill 0.3 pad 0.6)
  Top 0.203: U4.5 35.87,99.56 v35.88,99.58 | v31.61,87.71 36.53,82.79 v36.53,81.91
  Bottom 0.203: VERTICAL.14 45.19,73.25 v36.53,81.91 | v35.88,99.58 35.88,97.5 30.7,92.32 30.7,88.62 v31.61,87.71
15  (via drill 0.3 pad 0.6)
  Top 0.203: v29.39,87.71 33.12,83.98 v33.12,82.55 | U4.6 34.59,99.52 v34.66,99.58
  Bottom 0.203: v34.66,99.58 34.66,97.75 28.77,91.86 28.77,88.33 v29.39,87.71 | v33.12,82.55 42.42,73.25 VERTICAL.15
16  (via drill 0.3 pad 0.6)
  Top 0.203: U4.7 v33.33,99.57 | v31.41,82.39 31.41,83.88 v27.56,87.73
  Bottom 0.203: VERTICAL.16 39.65,74.15 v31.41,82.39 | v27.56,87.73 27.56,91.8 33.33,97.57 v33.33,99.57
17  (via drill 0.3 pad 0.6)
  Top 0.203: U8.15 19.75,91.22 20.01,90.95 v22.03,90.95 | v30.04,81.82 30.04,82.78 26.1,86.72 26.1,87.74 v26.13,87.77
  Bottom 0.203: VERTICAL.17 36.91,74.95 v30.04,81.82 | v26.13,87.77 23.42,87.77 22.03,89.16 v22.03,90.95
18  (via drill 0.3 pad 0.6)
  Top 0.203: U8.1 v21.05,99.39 v21.04,99.39
  Bottom 0.203: VERTICAL.18 34.14,73.72 26.8,81.06 26.76,81.1 21.55,86.31 21.29,86.57 21.04,86.82 v21.04,99.39
19  (via drill 0.3 pad 0.6)
  Top 0.203: U8.2 v19.77,99.36 v19.77,99.37
  Bottom 0.203: VERTICAL.19 31.37,73.84 19.77,85.44 v19.77,99.37
20  (via drill 0.3 pad 0.6)
  Top 0.203: U8.3 v18.5,99.39 v18.51,99.4
  Bottom 0.203: VERTICAL.20 28.63,75.42 18.51,85.54 v18.51,99.4
21  (via drill 0.3 pad 0.6)
  Top 0.203: U8.4 v17.23,99.36
  Bottom 0.203: VERTICAL.21 25.86,76.78 17.23,85.41 v17.23,99.36
22  (via drill 0.3 pad 0.6)
  Top 0.203: U8.5 15.95,97.81 v15.95,99.31
  Bottom 0.203: VERTICAL.22 23.09,77.55 15.95,84.69 v15.95,99.31
23  (via drill 0.3 pad 0.6)
  Top 0.203: U8.6 v14.7,99.36 v14.69,99.37
  Bottom 0.203: v14.69,99.37 14.69,83.82 20.35,78.16 VERTICAL.23
24  (via drill 0.3 pad 0.6)
  Top 0.203: U8.7 v13.43,99.36 v13.42,99.36
  Bottom 0.203: VERTICAL.24 17.58,78.04 14.62,81 13.55,82.07 13.42,82.2 v13.42,99.36
AGND  (1 unrouted)
GND  (via drill 0.3 pad 0.6)
  other vias: 17.88,93.96 12.22,94.93 35.67,96.12 35.31,93.98 43.16,93.9 43.24,97.13 48.58,96.33 48.66,93.91 46.06,93.22 70.46,23.18 73.34,51.36 65.4,51.18 60.3,42.91 60.49,45.7 69.87,47.7 19.29,13.01 14.18,21.61 35.07,10.34 12.56,57.62 106.53,53.44 112.68,65.17 121.38,85.03 144.82,82.59 140.06,53.32 106.77,14.99 11.36,88.34 14.67,103.09 26.42,100.75 42.61,103.58 59.77,103.65 70.87,102.6 63.62,86.4 80.94,96.96 106.06,97.76 107.35,79.23 88.75,78.42 74.98,68.83 70.31,78.99 63.22,75.12 138.13,44.3 139.82,70.96 84.7,25.82 62.04,57.86 73.25,57.77 84.85,61.83
  pour Bottom (isolate 0.203): 150,107 9,107 9,1 150,1
  pour Top (isolate 0.203): 150,107 9,107 9,1 150,1
H1  (via drill 0.3 pad 0.6)
  Top 0.203: U6.9 66.09,38.26 61.55,42.8 61.55,44.3 | R0001.1 61.09,51.2 60.81,50.92 60.58,50.69 60.4,50.51 60.4,46.81 61.55,45.66 61.55,44.3 | v60.79,44.27 60.82,44.3 61.55,44.3
  Bottom 0.203: HORIZONTAL.1 50.93,45.79 59.27,45.79 v60.79,44.27
H2  (via drill 0.3 pad 0.6)
  Top 0.203: R0001.2 62.45,46.83 | 62.45,46.83 62.45,42.91 66.04,39.32 66.45,38.91 U6.8 | 62.45,46.83 61.69,46.83 v61.66,46.8
  Bottom 0.203: HORIZONTAL.2 49.16,46.79 60.46,46.79 v61.66,46.8
H3  (via drill 0.3 pad 0.6)
  Top 0.203: U6.7 66.72,39.55 63.25,43.02 63.25,47.36 | R0001.3 63.25,47.36 | v63.92,47.37 63.26,47.37 63.25,47.36
  Bottom 0.203: HORIZONTAL.3 47.59,47.96 63.33,47.96 v63.92,47.37
H4  (via drill 0.3 pad 0.6)
  Top 0.2: U6.6 68.44,40.2 68.32,40.32
  Top 0.203: 68.44,40.2 68.32,40.32 65.31,43.33 65.31,48.93 64.72,49.52 | 64.72,49.52 64.14,50.1 R0001.4 | 64.72,49.52 64.12,48.91 v64.12,48.78
  Bottom 0.203: HORIZONTAL.4 45.64,48.78 v64.12,48.78
H5  (via drill 0.3 pad 0.6)
  Top 0.203: U6.5 69.28,40.85 66.18,43.95 66.18,50.21 | 66.18,50.21 66.18,55.26 R0003.5 | v65.19,50.15 66.12,50.15 66.18,50.21
  Bottom 0.203: HORIZONTAL.5 35.51,44.51 41.15,50.15 v65.19,50.15
H6  (via drill 0.3 pad 0.6)
  Top 0.203: U6.4 69.78,41.51 67.07,44.21 67.07,51.98 | R0003.6 67.07,51.98 | 67.07,51.98 67.69,51.98 v67.71,51.96
  Bottom 0.203: HORIZONTAL.6 32.77,43.98 40.74,51.95 v67.7,51.95 v67.71,51.96
H7  (via drill 0.3 pad 0.6)
  Top 0.203: U6.3 70.09,42.16 67.89,44.36 67.89,50.23 68.52,50.86 68.52,53.33 | 68.52,53.33 68.52,53.87 67.87,54.52 R0003.7 | v67.75,53.27 68.46,53.27 68.52,53.33
  Bottom 0.203: HORIZONTAL.7 30,43.54 39.73,53.27 v67.75,53.27
H8  (via drill 0.3 pad 0.6)
  Top 0.203: U6.2 70.28,42.8 68.65,44.44 68.65,49.57 70.07,50.99 70.07,54.35 | 70.07,54.35 70.07,54.92 69.67,55.32 R0003.8 | v69.25,54.35 70.07,54.35
  Bottom 0.203: HORIZONTAL.8 27.23,44.25 37.33,54.35 v69.25,54.35
H9  (via drill 0.3 pad 0.6)
  Top 0.203: U6.23 79.67,42.8 80.04,43.17 80.04,47.69 77.19,50.54 77.19,55.34 | 77.19,55.34 77.19,57.46 78.16,58.43 R0004.5 | v75.58,55.32 75.6,55.34 77.19,55.34
  Bottom 0.203: HORIZONTAL.9 24.49,45.87 33.94,55.32 v75.58,55.32
H10  (via drill 0.3 pad 0.6)
  Top 0.203: U6.22 79.83,42.16 80.7,43.02 80.7,48.13 78.03,50.8 78.03,55.68 | 78.03,55.68 78.03,56.33 78.61,56.91 81.38,56.91 81.9,57.43 81.88,57.45 R0004.6 | 78.03,55.68 78.05,55.7 v78.73,55.7
  Bottom 0.203: HORIZONTAL.10 21.72,48.1 30.57,56.95 77.48,56.95 v78.73,55.7
H11  (via drill 0.3 pad 0.6)
  Top 0.203: U6.21 81.14,41.51 81.92,42.29 81.92,48.1 80.95,49.07 80.95,54.37 | R0004.7 82.68,57.32 80.95,55.59 80.95,54.37 | 80.95,54.37 v80.24,54.37 v80.23,54.38
  Bottom 0.203: HORIZONTAL.11 18.95,47.93 29.75,58.73 77.29,58.73 80.23,55.79 v80.23,54.38
H12  (via drill 0.3 pad 0.6)
  Top 0.203: U6.20 81.5,40.85 83.58,42.94 83.58,54.46 | R0004.8 83.58,54.46 | 83.58,54.46 v82.58,54.46 v82.57,54.47
  Bottom 0.203: HORIZONTAL.12 16.21,48.42 28.49,60.7 78.02,60.7 82.53,56.19 82.53,54.51 v82.57,54.47
H13  (via drill 0.3 pad 0.6)
  Top 0.203: U6.19 82,40.2 84.35,42.56 84.35,57.19 86.37,59.21 R0005.5 84.37,63.6 v84.31,63.54
  Bottom 0.203: HORIZONTAL.13 13.44,48.24 27.43,62.23 83,62.23 v84.31,63.54
H14  (via drill 0.3 pad 0.6)
  Top 0.203: R0005.6 87.27,44.39 82.44,39.55 U6.18 76.86,39.55 76.45,39.96 v75.01,39.96
  Bottom 0.2: 62.98,39.96 v75.01,39.96
  Bottom 0.203: HORIZONTAL.14 49.1,34.67 57.69,34.67 62.98,39.96
H15  (via drill 0.3 pad 0.6)
  Top 0.203: R0005.7 88.07,43.8 83.17,38.91 U6.17 75.33,38.91 v75.28,38.95
  Bottom 0.203: HORIZONTAL.15 47.75,33.25 58.1,33.25 63.8,38.95 v75.28,38.95
H16  (via drill 0.3 pad 0.6)
  Top 0.203: R0005.8 88.97,42.98 84.25,38.26 U6.16 75.56,38.26 v75.15,37.85
  Bottom 0.203: HORIZONTAL.16 45.66,32.57 59.63,32.57 64.91,37.85 v75.15,37.85
H17  (via drill 0.3 pad 0.6)
  Top 0.203: R0006.5 60.8,16.83 61.7,16.83 62.49,17.62 62.49,25.18 | U5.9 62.84,26.38 62.49,26.03 62.49,25.18 | v61.61,25.16 62.47,25.16 62.49,25.18
  Bottom 0.203: HORIZONTAL.17 36.91,30.08 41.83,25.16 v61.61,25.16
H18  (via drill 0.3 pad 0.6)
  Top 0.203: R0006.6 59.88,22.72 59.88,24.29 | 59.88,24.29 59.88,24.93 61.98,27.02 U5.8 | v60.65,24.25 59.92,24.25 59.88,24.29
  Bottom 0.203: HORIZONTAL.18 34.14,25.42 35.42,24.14 60.53,24.14 v60.65,24.25
H19  (via drill 0.3 pad 0.6)
  Top 0.203: 59.08,23.31 59.08,25.88 60.88,27.68 U5.7 | v58.16,23.31 59.08,23.31 | 59.08,23.31 R0006.7
  Bottom 0.203: v58.16,23.31 43.75,23.31 43.57,23.31 35.05,23.31 31.37,26.99 HORIZONTAL.19
H20  (via drill 0.3 pad 0.6)
  Top 0.203: R0006.8 58.18,18.39 57.08,19.49 57.08,22.36 | U5.6 58.55,28.32 57.08,26.85 57.08,22.36 | v55.95,22.39 57.05,22.39 57.08,22.36
  Bottom 0.203: HORIZONTAL.20 28.63,27.27 33.5,22.4 54.82,22.4 v55.95,22.39
H21  (via drill 0.3 pad 0.6)
  Top 0.203: R0002.5 51.77,16.85 52.29,17.37 52.29,21.49 | 52.29,21.49 52.29,28.21 53.05,28.98 U5.5 | 52.29,21.49 51.41,21.49 v51.38,21.46
  Bottom 0.203: HORIZONTAL.21 25.86,27.76 32.16,21.46 v51.38,21.46
H22  (via drill 0.3 pad 0.6)
  Top 0.203: U5.4 51.49,29.62 49.9,28.03 49.9,20.63 | 49.9,20.63 R0002.6 | 49.9,20.63 v49.17,20.63
  Bottom 0.203: HORIZONTAL.22 23.09,27.58 30.04,20.63 v49.17,20.63
H23  (via drill 0.3 pad 0.6)
  Top 0.203: R0002.7 49.1,17.56 47.6,19.06 47.6,21.26 | 47.6,21.26 46.63,21.26 45.58,20.21 v45.58,19.41 v45.57,19.4 | U5.3 50.28,30.27 48.2,28.2 47.62,27.61 47.6,27.59 47.6,21.26
  Bottom 0.203: HORIZONTAL.23 20.35,27.75 28.7,19.4 v45.57,19.4
H24  (via drill 0.3 pad 0.6)
  Top 0.203: R0002.8 45.57,16.85 | 45.57,16.85 44,16.85 41.85,19 41.85,25.18 47.59,30.93 U5.2 | 45.57,16.85 45.57,18.27 v45.52,18.32
  Bottom 0.203: HORIZONTAL.24 17.58,27.96 27.22,18.32 v45.52,18.32
H25  (via drill 0.3 pad 0.6)
  Top 0.2: HORIZONTAL.25 14.81,32.37 27.01,20.17 39.55,20.17 40.47,19.25 40.47,16.88 R0007.5 v41.9,16.84 | v76.16,27.17 76.16,29.74 77.34,30.92 U5.23
  Bottom 0.2: v41.9,16.84 65.83,16.84 v76.16,27.17
LED1  (via drill 0.35)
  Top 0.2: R0013.5 132.93,61.3 131.33,62.9 v131.33,66.79
  Bottom 0.2: v131.33,66.79 131.33,82.63 118.39,95.57 102.7,95.57 TEENSY_2.2
LED2  (via drill 0.3 pad 0.6)
  Top 0.2: R0013.6 131.87,60.4 v130.31,61.96 v130.31,61.97
  Bottom 0.2: v130.31,61.97 118.25,74.03 TEENSY_2.14/A0
LED3  (via drill 0.3 pad 0.6)
  Top 0.2: R0013.7 v130.08,59.6 v130.07,59.59
  Bottom 0.2: v130.07,59.59 120.96,68.7 113.96,68.7 112.8,69.86 112.8,80.45 109.05,84.2 TEENSY_2.7
LED4  (via drill 0.3 pad 0.6)
  Top 0.2: R0013.8 131.99,58.7 v131.23,57.94
  Bottom 0.2: v131.23,57.94 115.8,57.94 105.33,68.42 105.16,68.58 105.16,80.43 103.94,81.65 TEENSY_2.8
LED5  (via drill 0.35)
  Top 0.2: R0012.8 132.2,48.7 128.13,52.77 v128.13,70.41 v128.14,70.42
  Bottom 0.2: TEENSY_2.6 112.57,86.73 113.82,85.48 118.09,85.48 128.14,75.43 v128.14,70.42
N$2
  Top 0.203: R0013.4 147.76,61.3 X3.1
N$3
  Top 0.203: R0013.3 145.92,60.4 X3.2
N$4
  Top 0.203: U8.14 18.45,91.87 18.45,90.78 19.01,90.22 22.83,90.22 24.79,92.18 U4.9
N$6
  Top 0.203: R0013.2 143.98,59.6 X3.3
N$7
  Top 0.203: R0013.1 142.13,58.7 X3.4
N$8
  Bottom 0.254: TEENSY_2.15/A1 TEENSY_2.16/A2
N$10
  Top 0.61: X5.2 132.46,95.61 F2.P$1
N$20
  Top 0.203: R0012.1 147.76,48.7 X3.5
S0  (via drill 0.3 pad 0.6)
  Top 0.203: U5.10 69.17,25.73 v68.65,25.2 | v75.12,36.78 74.3,37.6 U6.10 64.82,37.6 62.42,37.6 59.25,40.78 59.25,74.59 66.31,81.65 TEENSY_1.8
  Bottom 0.203: v68.65,25.2 68.65,30.31 v75.12,36.78
S1  (via drill 0.3 pad 0.6)
  Top 0.203: U5.11 72.61,25.07 74.24,26.71 74.24,29.34 | 74.24,29.34 74.24,36.15 73.44,36.95 U6.11 60.7,36.95 58.34,39.31 58.34,77.34 65.19,84.19 TEENSY_1.7 | 74.24,29.34 75.3,29.34 v75.35,29.29
  Bottom 0.203: v75.35,29.29 86.86,29.29 v87.96,30.39
S2  (via drill 0.3 pad 0.6)
  Top 0.203: U5.14 79.75,25.07 81.24,26.57 81.24,36.94 81.22,36.95 | v94.3,46.11 85.14,36.95 81.22,36.95 | 81.22,36.95 U6.14
  Bottom 0.203: TEENSY_1.6 69.7,86.73 68.06,85.09 68.06,67.13 69.45,65.74 90.8,65.74 94.33,62.21 94.33,46.08 v94.3,46.11
S3  (via drill 0.3 pad 0.6)
  Top 0.203: U6.13 78.72,36.24 v78.72,35.45 | v82.34,35.45 82.34,31.33 | 82.34,31.33 82.34,26.72 80.05,24.43 U5.13 | v95.58,42.84 95.58,38.76 88.15,31.33 82.34,31.33
  Bottom 0.203: v78.72,35.45 v82.34,35.45 | v95.58,42.84 93.32,45.1 93.32,61.65 90.54,64.43 68.95,64.43 66.87,66.51 66.87,86.44 69.7,89.27 TEENSY_1.5
SERIAL_IN
  Top 0.203: TEENSY_1.2 72.47,96.89 65.47,89.89 55.99,89.89 54.91,90.97 U2.14
SERIAL_OUT0
  Top 0.203: U4.14 38.45,91.22 39.46,90.21 45.72,90.2 47.84,90.2 48.54,90.9 48.54,92.19 U2.9
SHCP  (via drill 0.3 pad 0.6)
  Top 0.203: U8.11 14.61,92.12 14.61,90.28 16.44,88.45 34.54,88.45 | TEENSY_1.4 70.57,91.81 67.21,88.45 50.93,88.45 | 50.93,88.45 34.54,88.45 | U2.11 51.09,90.67 v51.11,90.66 | v50.96,86.89 50.96,88.42 50.93,88.45 | U4.11 34.59,90.53 v34.57,90.5 | v34.55,87.78 34.55,88.44 34.54,88.45
  Bottom 0.203: v51.11,90.66 51.11,87.04 v50.96,86.89 | v34.55,87.78 34.55,90.48 v34.57,90.5
STCP
  Top 0.203: U8.12 15.94,90.19 16.97,89.16 35.87,89.16 | TEENSY_1.3 71.54,94.35 66.35,89.16 52.35,89.16 | 52.35,89.16 35.87,89.16 | U4.12 35.87,89.17 35.87,89.16 | U2.12 52.37,89.17 52.35,89.16
TEENSY1_17
  Bottom 0.203: TEENSY_1.17/A3 95.94,81.65 96.44,81.15 96.84,80.75 97.02,80.57 97.02,33.24 74.52,10.74 X1.5
TEENSY1_18
  Bottom 0.203: TEENSY_1.18/A4 96.4,84.19 98.26,82.33 98.26,31.47 97.28,30.49 96.38,29.59 77.27,10.48 X1.4
TEENSY1_19
  Bottom 0.203: TEENSY_1.19/A5 97.4,86.73 99.13,85 99.13,30.37 80.01,11.25 X1.3
TEENSY1_A8  (via drill 0.3 pad 0.6)
  Top 0.203: U5.1 73.22,31.57 v73.25,31.55 | TEENSY_1.22/A8 93.71,94.44 95.59,94.44 96.24,93.79 96.24,45.14 v83.74,32.64
  Bottom 0.203: v73.25,31.55 77.28,31.55 78.39,32.66 83.72,32.66 v83.74,32.64
TEENSY1_A9
  Top 0.203: U6.1 71.34,74.58 76.99,80.23 81.29,80.23 87.9,86.84 87.9,95.87 88.92,96.89 TEENSY_1.23/A9

### Text on the board
tNames: GND | GND | 5V | 5V | 5V | RX1 | + | - | TX1 | SERIAL_IN | A9 | LED1 | C1 | 10uF | STCP | A8 | SHCP | S3 | S2 | IO19 | LED5 | S1 | IO18 | LED3 | S0 | IO17 | LED4 | IO9 | IO10 | GND | GND | LED2 | HitBox V0.3
bNames: GND | GND | 5V | 5V | 5V | RX1 | + | - | TX1 | SERIAL_IN | A9 | LED1 | STCP | A8 | SHCP | TEENSY_1 | TEENSY_2 | S3 | S2 | IO19 | LED5 | S1 | IO18 | LED3 | S0 | IO17 | LED4 | IO9 | IO10 | GND | LED2 | GND